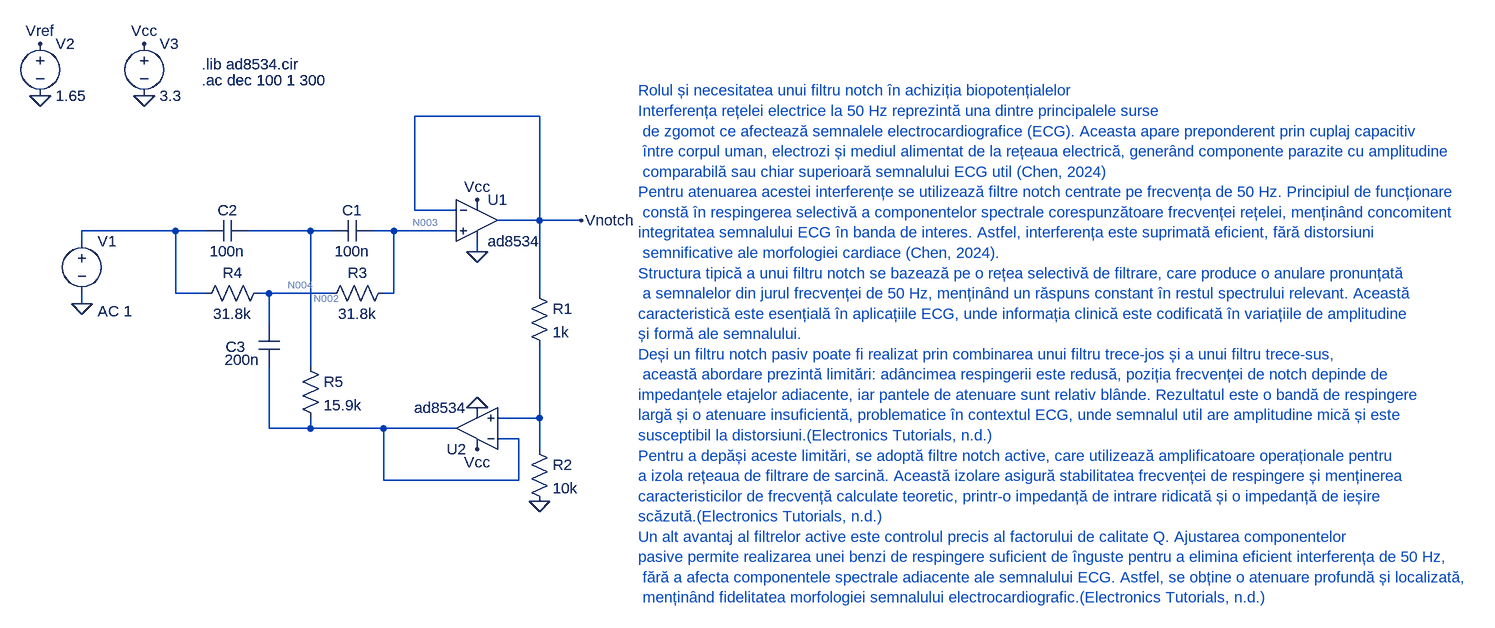
[diagram p0: schematic FiltruNotch.asc]
FiltruNotch.asc, the LTspice schematic file:
Version 4.1
SHEET 1 1788 680
WIRE 512 -64 320 -64
WIRE 320 80 320 -64
WIRE 384 80 320 80
WIRE 512 96 512 -64
WIRE 512 96 448 96
WIRE 576 96 512 96
WIRE -48 112 -192 112
WIRE 0 112 -48 112
WIRE 160 112 64 112
WIRE 192 112 160 112
WIRE 288 112 256 112
WIRE 384 112 288 112
WIRE -192 128 -192 112
WIRE 416 144 416 128
WIRE -48 208 -48 112
WIRE 0 208 -48 208
WIRE 96 208 80 208
WIRE 192 208 96 208
WIRE 288 208 288 112
WIRE 288 208 272 208
WIRE 512 208 512 96
WIRE -192 224 -192 208
WIRE 96 256 96 208
WIRE 160 320 160 112
WIRE 512 400 512 288
WIRE 512 400 448 400
WIRE 96 416 96 320
WIRE 160 416 160 400
WIRE 160 416 96 416
WIRE 272 416 160 416
WIRE 384 416 272 416
WIRE 480 432 448 432
WIRE 512 448 512 400
WIRE 272 496 272 416
WIRE 480 496 480 432
WIRE 480 496 272 496
FLAG 416 144 0
FLAG 416 64 Vcc
FLAG 576 96 Vnotch
FLAG 416 448 Vcc
FLAG 416 384 0
FLAG -192 224 0
FLAG -256 -176 Vref
FLAG -256 -96 0
FLAG -96 -96 0
FLAG -96 -176 Vcc
FLAG 512 528 0
SYMBOL OpAmps\\opamp2 416 32 R0
SYMATTR InstName U1
SYMATTR Value ad8534
SYMBOL res 496 192 R0
SYMATTR InstName R1
SYMATTR Value 1k
SYMBOL res 496 432 R0
SYMATTR InstName R2
SYMATTR Value 10k
SYMBOL cap 256 96 R90
WINDOW 0 0 32 VBottom 2
WINDOW 3 32 32 VTop 2
SYMATTR InstName C1
SYMATTR Value 100n
SYMBOL cap 64 96 R90
WINDOW 0 0 32 VBottom 2
WINDOW 3 32 32 VTop 2
SYMATTR InstName C2
SYMATTR Value 100n
SYMBOL res 288 192 R90
WINDOW 0 0 56 VBottom 2
WINDOW 3 32 56 VTop 2
SYMATTR InstName R3
SYMATTR Value 31.8k
SYMBOL res 96 192 R90
WINDOW 0 0 56 VBottom 2
WINDOW 3 32 56 VTop 2
SYMATTR InstName R4
SYMATTR Value 31.8k
SYMBOL cap 80 256 R0
WINDOW 0 -51 34 Left 2
WINDOW 3 -52 54 Left 2
SYMATTR InstName C3
SYMATTR Value 200n
SYMBOL res 144 304 R0
SYMATTR InstName R5
SYMATTR Value 15.9k
SYMBOL OpAmps\\opamp2 416 480 R180
SYMATTR InstName U2
SYMATTR Value ad8534
SYMBOL voltage -192 112 R0
WINDOW 123 24 124 Left 2
WINDOW 39 0 0 Left 0
SYMATTR Value2 AC 1
SYMATTR InstName V1
SYMATTR Value ""
SYMBOL voltage -256 -192 R0
WINDOW 123 0 0 Left 0
WINDOW 39 0 0 Left 0
SYMATTR InstName V2
SYMATTR Value 1.65
SYMBOL voltage -96 -192 R0
SYMATTR InstName V3
SYMATTR Value 3.3
TEXT -8 -120 Left 2 !.ac dec 100 1 300
TEXT -8 -144 Left 2 !.lib ad8534.cir
TEXT 664 -104 Left 2 ;Rolul și necesitatea unui filtru notch în achiziția biopotențialelor\nInterferența rețelei electrice la 50 Hz reprezintă una dintre principalele surse\n de zgomot ce afectează semnalele electrocardiografice (ECG). Aceasta apare preponderent prin cuplaj capacitiv\n între corpul uman, electrozi și mediul alimentat de la rețeaua electrică, generând componente parazite cu amplitudine\n comparabilă sau chiar superioară semnalului ECG util (Chen, 2024)\nPentru atenuarea acestei interferențe se utilizează filtre notch centrate pe frecvența de 50 Hz. Principiul de funcționare\n constă în respingerea selectivă a componentelor spectrale corespunzătoare frecvenței rețelei, menținând concomitent \nintegritatea semnalului ECG în banda de interes. Astfel, interferența este suprimată eficient, fără distorsiuni\n semnificative ale morfologiei cardiace (Chen, 2024).\nStructura tipică a unui filtru notch se bazează pe o rețea selectivă de filtrare, care produce o anulare pronunțată\n a semnalelor din jurul frecvenței de 50 Hz, menținând un răspuns constant în restul spectrului relevant. Această \ncaracteristică este esențială în aplicațiile ECG, unde informația clinică este codificată în variațiile de amplitudine \nși formă ale semnalului.\nDeși un filtru notch pasiv poate fi realizat prin combinarea unui filtru trece-jos și a unui filtru trece-sus,\n această abordare prezintă limitări: adâncimea respingerii este redusă, poziția frecvenței de notch depinde de \nimpedanțele etajelor adiacente, iar pantele de atenuare sunt relativ blânde. Rezultatul este o bandă de respingere \nlargă și o atenuare insuficientă, problematice în contextul ECG, unde semnalul util are amplitudine mică și este \nsusceptibil la distorsiuni.(Electronics Tutorials, n.d.)\nPentru a depăși aceste limitări, se adoptă filtre notch active, care utilizează amplificatoare operaționale pentru \na izola rețeaua de filtrare de sarcină. Această izolare asigură stabilitatea frecvenței de respingere și menținerea \ncaracteristicilor de frecvență calculate teoretic, printr-o impedanță de intrare ridicată și o impedanță de ieșire \nscăzută.(Electronics Tutorials, n.d.)\nUn alt avantaj al filtrelor active este controlul precis al factorului de calitate Q. Ajustarea componentelor \npasive permite realizarea unei benzi de respingere suficient de înguste pentru a elimina eficient interferența de 50 Hz,\n fără a afecta componentele spectrale adiacente ale semnalului ECG. Astfel, se obține o atenuare profundă și localizată,\n menținând fidelitatea morfologiei semnalului electrocardiografic.(Electronics Tutorials, n.d.)

The netlist it stands for:
* FiltruNotch.asc
X§U1 N003 Vnotch Vcc 0 Vnotch ad8534  ; pins In+ In- V+ V- OUT
R1 Vnotch N005 1k
R2 N005 0 10k
C1 N003 N002 100n
C2 N002 N001 100n
R3 N003 N004 31.8k
R4 N004 N001 31.8k
C3 N004 N006 200n
R5 N002 N006 15.9k
X§U2 N005 N006 Vcc 0 N006 ad8534  ; pins In+ In- V+ V- OUT
V1 N001 0 AC 1
V2 Vref 0 1.65
V3 Vcc 0 3.3
.ac dec 100 1 300
.lib ad8534.cir
* Rolul și necesitatea unui filtru notch în achiziția biopotențialelor
* Interferența rețelei electrice la 50 Hz reprezintă una dintre principalele surse
*  de zgomot ce afectează semnalele electrocardiografice (ECG). Aceasta apare preponderent prin cuplaj capacitiv
*  între corpul uman, electrozi și mediul alimentat de la rețeaua electrică, generând componente parazite cu amplitudine
*  comparabilă sau chiar superioară semnalului ECG util (Chen, 2024)
* Pentru atenuarea acestei interferențe se utilizează filtre notch centrate pe frecvența de 50 Hz. Principiul de funcționare
*  constă în respingerea selectivă a componentelor spectrale corespunzătoare frecvenței rețelei, menținând concomitent
* integritatea semnalului ECG în banda de interes. Astfel, interferența este suprimată eficient, fără distorsiuni
*  semnificative ale morfologiei cardiace (Chen, 2024).
* Structura tipică a unui filtru notch se bazează pe o rețea selectivă de filtrare, care produce o anulare pronunțată
*  a semnalelor din jurul frecvenței de 50 Hz, menținând un răspuns constant în restul spectrului relevant. Această
* caracteristică este esențială în aplicațiile ECG, unde informația clinică este codificată în variațiile de amplitudine
* și formă ale semnalului.
* Deși un filtru notch pasiv poate fi realizat prin combinarea unui filtru trece-jos și a unui filtru trece-sus,
*  această abordare prezintă limitări: adâncimea respingerii este redusă, poziția frecvenței de notch depinde de
* impedanțele etajelor adiacente, iar pantele de atenuare sunt relativ blânde. Rezultatul este o bandă de respingere
* largă și o atenuare insuficientă, problematice în contextul ECG, unde semnalul util are amplitudine mică și este
* susceptibil la distorsiuni.(Electronics Tutorials, n.d.)
* Pentru a depăși aceste limitări, se adoptă filtre notch active, care utilizează amplificatoare operaționale pentru
* a izola rețeaua de filtrare de sarcină. Această izolare asigură stabilitatea frecvenței de respingere și menținerea
* caracteristicilor de frecvență calculate teoretic, printr-o impedanță de intrare ridicată și o impedanță de ieșire
* scăzută.(Electronics Tutorials, n.d.)
* Un alt avantaj al filtrelor active este controlul precis al factorului de calitate Q. Ajustarea componentelor
* pasive permite realizarea unei benzi de respingere suficient de înguste pentru a elimina eficient interferența de 50 Hz,
*  fără a afecta componentele spectrale adiacente ale semnalului ECG. Astfel, se obține o atenuare profundă și localizată,
*  menținând fidelitatea morfologiei semnalului electrocardiografic.(Electronics Tutorials, n.d.)
.backanno
.end

* Results of the author's LTspice run, read from the files saved beside the schematic
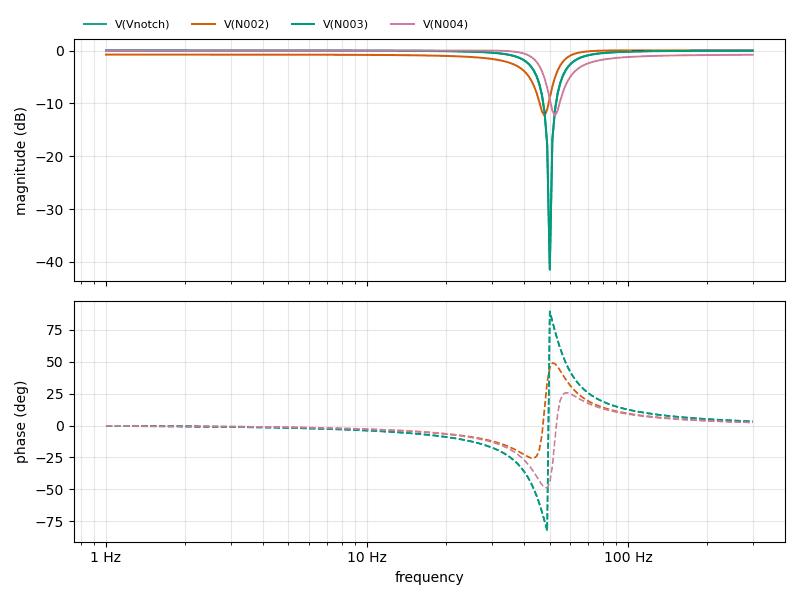
[diagram p1: AC Analysis of FiltruNotch.asc, plotted from the saved traces]
* AC Analysis, 1 run:
*   V(Vnotch): 0.04 dB at 1 Hz, 0.02 dB at 300 Hz, peak 0.04 dB at 1 Hz, 3 dB below the peak at 42.42 Hz
*   V(N002): -0.75 dB at 1 Hz, 0.01 dB at 300 Hz, peak 0.04 dB at 102.3 Hz, 3 dB below the peak at 54.74 Hz
*   V(N003): -0.00 dB at 1 Hz, -0.01 dB at 300 Hz, peak -0.00 dB at 1 Hz, 3 dB below the peak at 42.42 Hz
*   V(N004): 0.00 dB at 1 Hz, -0.79 dB at 300 Hz, peak 0.04 dB at 24.55 Hz, 3 dB below the peak at 45.77 Hz